# EAGLE design telemetria (EAGLE 9.6.2)
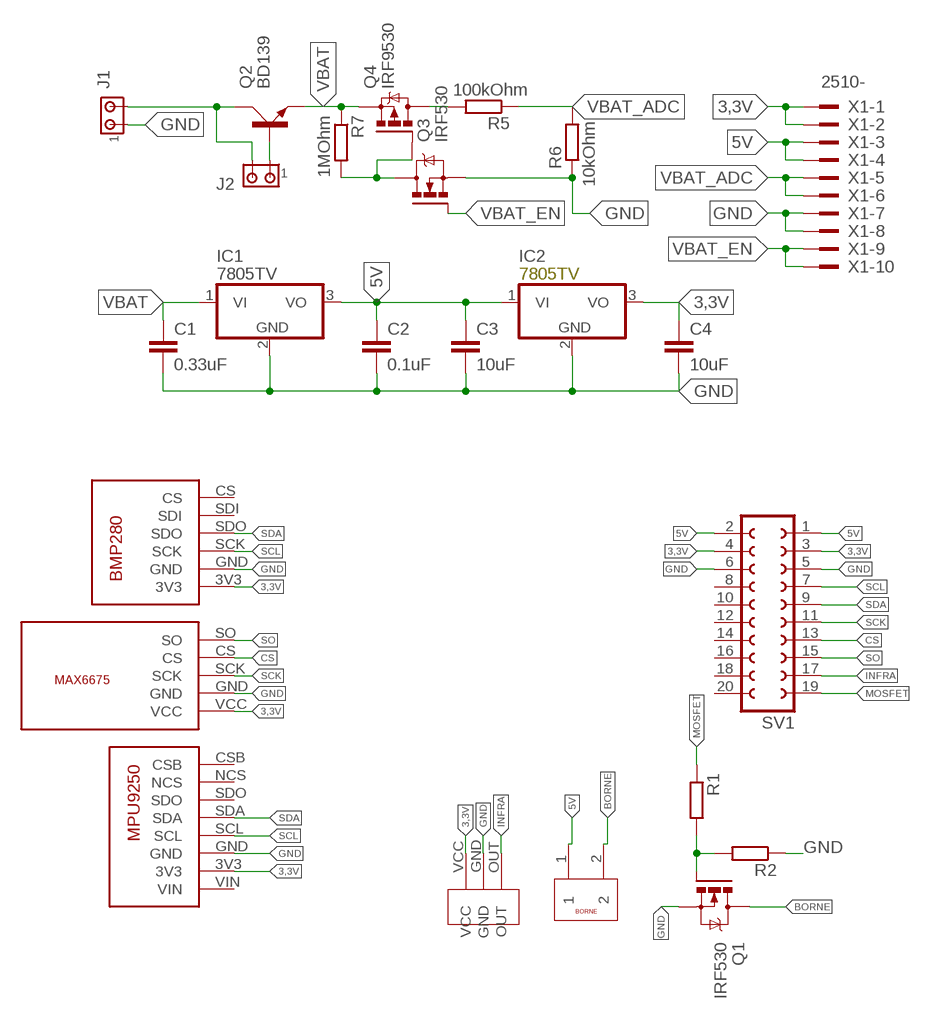
[diagram p0: schematic, sheet 1]

## Parts
C1  0.33uF  C2,5-3  [C2.5-3]
C2  0.1uF  C2,5-3  [C2.5-3]
C3  10uF  C2,5-3  [C2.5-3]
C4  10uF  C2,5-3  [C2.5-3]
IC1  7805TV  [TO220V]
IC2  7805TV  [TO220V]
J1  MTA02-156  [1X2MTA]
J2  MTA02-100  [10X02MTA]
Q1  IRF530  [TO220BV]
Q2  BD139  [TO126AV]
Q3  IRF530  [TO220BV]
Q4  IRF9530  [TO220BV]
R1  R-EU_0204/7  [0204/7]
R2  R-EU_0207/10  [0207/10]
R5  100kOhm  R-EU_0207/10  [0207/10]
R6  10kOhm  R-EU_0207/10  [0207/10]
R7  1MOhm  R-EU_0207/10  [0207/10]
SV1  FE10-2  [FE10-2]
U$1  BMP280  [BMP280]
U$2  MAX6675  [MAX6675]
U$3  MPU9250  [MP9250]
U$4  PIN-INFRA  [PIN-INFRA]
U$5  BORNE  [BORNE]
X1  2510-  [PAK100/2500-10]

## Nets
3,3V: C4.1 IC2.3(VO) SV1.3 SV1.4 U$1.3V3 U$2.VCC U$3.3V3 U$4.VCC X1.1 X1.2
5V: C2.1 C3.1 IC1.3(VO) IC2.1(VI) SV1.1 SV1.2 U$5.1 X1.3 X1.4
BORNE: Q1.D U$5.2
CS: SV1.13 U$2.CS
GND: C1.2 C2.2 C3.2 C4.2 IC1.2(GND) IC2.2(GND) J1.1 Q1.S Q3.S R2.1 R6.1 SV1.5 SV1.6 U$1.GND U$2.GND U$3.GND U$4.GND X1.7 X1.8
INFRA: SV1.17 U$4.OUT
MOSFET: Q1.G R1.1 R1.2 R2.2 SV1.19
N$3: J2.1 Q2.B
N$10: Q4.D R5.2
N$11: J1.2 J2.2 Q2.C
N$12: Q3.D Q4.G R7.2
SCK: SV1.11 U$2.SCK
SCL: SV1.7 U$1.SCK U$3.SCL
SDA: SV1.9 U$1.SDO U$3.SDA
SO: SV1.15 U$2.SO
VBAT: C1.1 IC1.1(VI) Q2.E Q4.S R7.1
VBAT_ADC: R5.1 R6.2 X1.5 X1.6
VBAT_EN: Q3.G X1.9 X1.10
Unconnected: SV1.8 SV1.10 SV1.12 SV1.14 SV1.16 SV1.18 SV1.20 U$1.CS U$1.SDI U$3.CSB U$3.NCS U$3.SDO U$3.VIN

## Library data of the parts
C1-C4 = capacitor-wima:C: CAPACITOR naming: grid - package width
IC1 IC2 = linear:78*: Positive VOLTAGE REGULATOR Source: http://cache.national.com/ds/LM/LM78L05.pdf http://www.fairchildsemi.com/ds/LM/LM7805.pdf
J1 = con-amp:MTA02-156: AMP connector
J2 = con-amp:MTA02-100: AMP connector
Q1 Q3 = transistor-power:IRF530: HEXFET Power MOSFET
Q2 = transistor-power:BD139: NPN TRANSISTOR
Q4 = transistor-power:IRF9530: P-CHANNEL HEXFET POWER-MOS-FET Source: http://www.irf.com/product-info/datasheets/data/irf9530.pdf
R1 R2 R5-R7 = rcl:R-EU_: RESISTOR, European symbol; SPICEPREFIX: R
SV1 = con-lsta:FE10-2: FEMALE HEADER; OC_FARNELL: unknown; OC_NEWARK: unknown
U$1 = BMP280:BMP280
U$2 = MAX6675:MAX6675
U$3 = MPU9250:MPU9250
U$4 = PIN-INFRA:PIN-INFRA
U$5 = BORNE:BORNE
X1 = con-3m:2510-: 3M (TM) Pak 100 4-Wall Header Source: 3M; MF: 3M; MPN: 2510-6002UB; OC_FARNELL: 9838244; OC_NEWARK: 46F4725

## Board
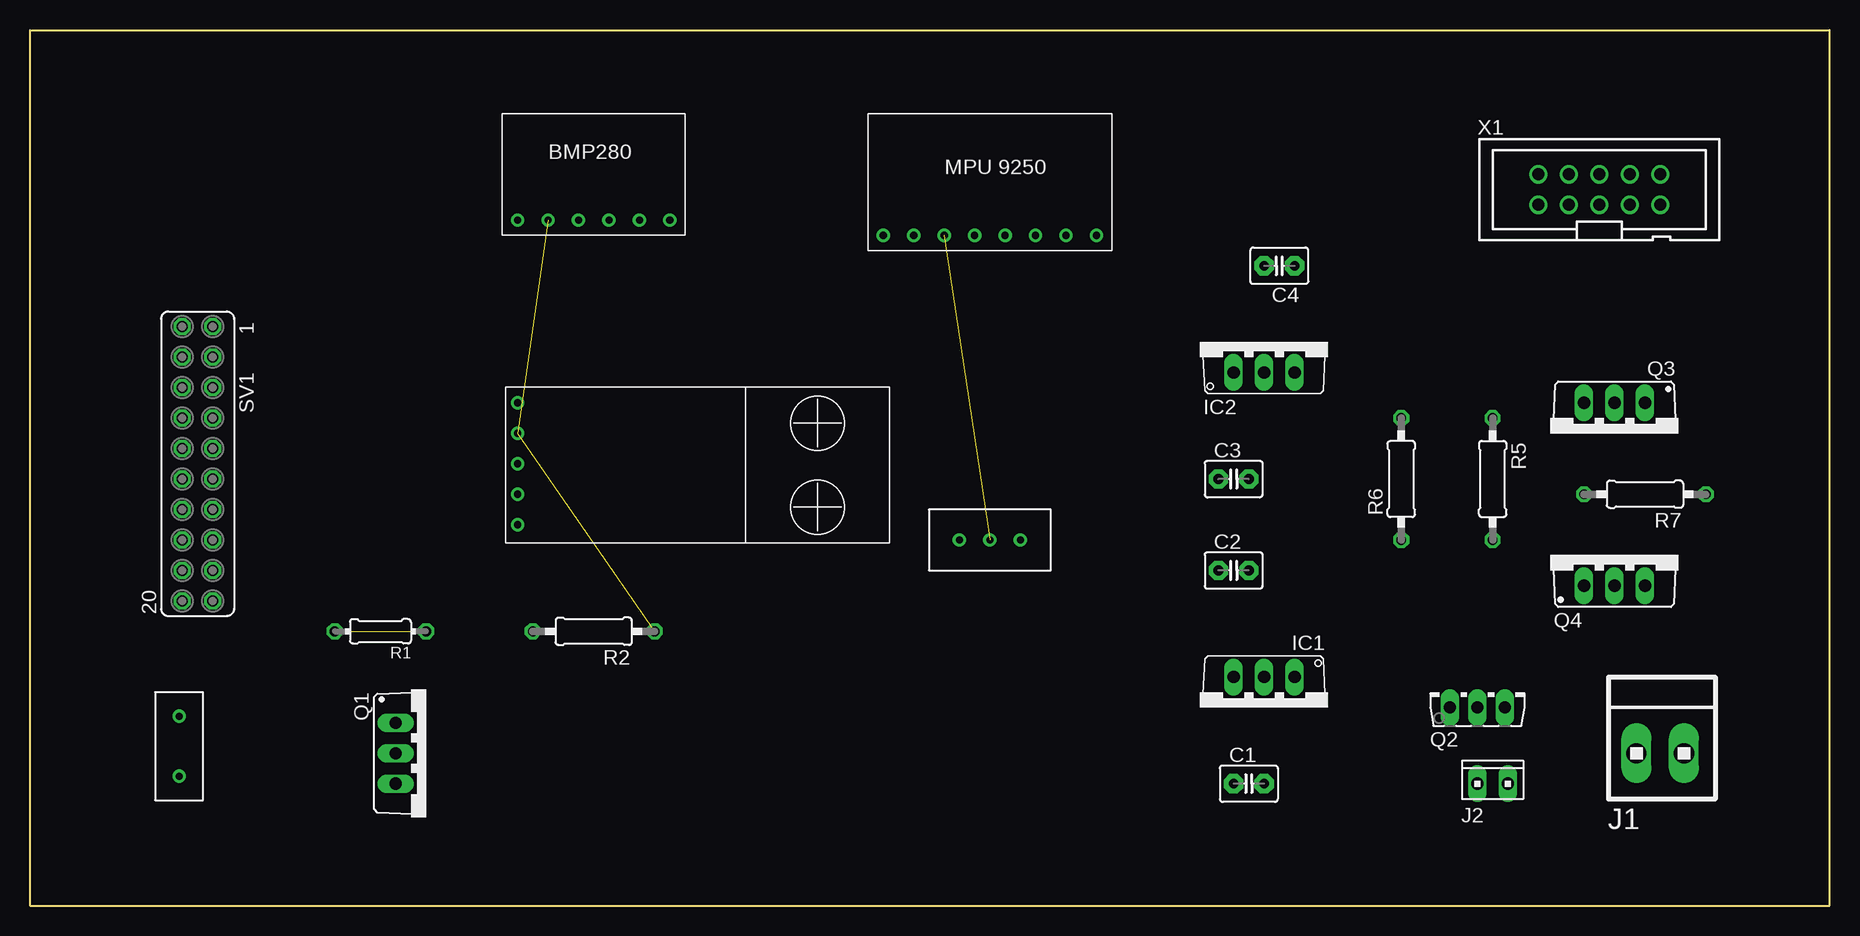
[diagram p1: board, top side]
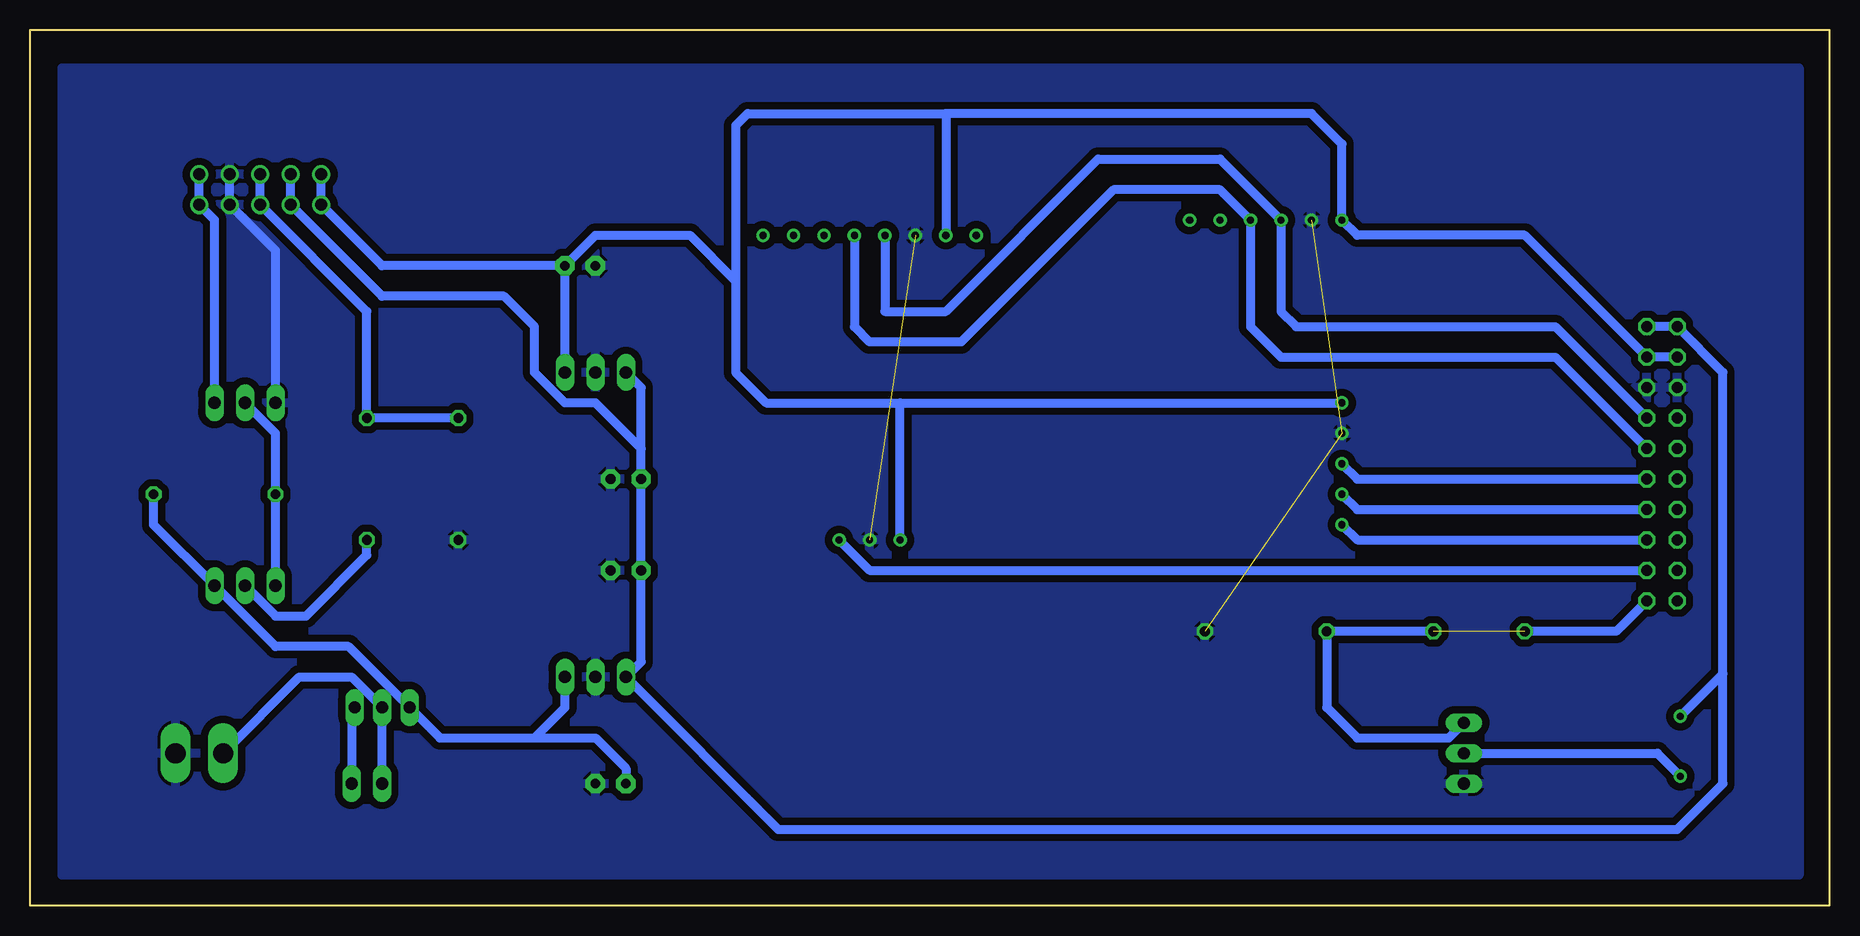
[diagram p2: board, bottom side, seen from below]

Size 150 x 73 mm. Coordinates in mm from the lower left corner, seen from the top.
Outline: 0,0 150,0 150,73 0,73 0,0
Copper layers (1*16): Top 0.035mm / dielectric 1.5mm / Bottom 0.035mm
Design rules "default *": minimum track width 6mil, minimum drill 0.35mm, track to track 6mil, track to pad 6mil, pad to pad 6mil, via to via 6mil, smd to smd 6mil, copper to edge 40mil, drill to drill 6mil, minimum pad ring 10mil, minimum via ring 8mil, stop-mask expansion 4mil, vias tented up to drill 0mil, thermal gap 10mil

### Footprints (pad centres in the part's own frame; a part is rotated, then mirrored left to right if it is on the bottom)
C2.5-3 = drill 0.813 pad 1.6 octagon: 1 -1.27,0; 2 1.27,0
TO220V = drill 1.016 long: 1 -2.54,-2.54; 2 0,-2.54; 3 2.54,-2.54
1X2MTA = drill 1.676 long: 1 1.981,0; 2 -1.981,0
10X02MTA = drill 1.016 long: 1 1.27,0; 2 -1.27,0
TO220BV = drill 1.016 long: D 0,-2.54; G -2.54,-2.54; S 2.54,-2.54
TO126AV = drill 1.016 long: B 2.286,-1.27; C 0,-1.27; E -2.286,-1.27
0204/7 = drill 0.813 octagon: 1 -3.81,0; 2 3.81,0
0207/10 = drill 0.813 octagon: 1 -5.08,0; 2 5.08,0
FE10-2 = drill 0.914 octagon: 1 -11.43,1.27; 2 -11.43,-1.27; 3 -8.89,1.27; 4 -8.89,-1.27; 5 -6.35,1.27; 6 -6.35,-1.27; 7 -3.81,1.27; 8 -3.81,-1.27; 9 -1.27,1.27; 10 -1.27,-1.27; 11 1.27,1.27; 12 1.27,-1.27; 13 3.81,1.27; 14 3.81,-1.27; 15 6.35,1.27; 16 6.35,-1.27; 17 8.89,1.27; 18 8.89,-1.27; 19 11.43,1.27; 20 11.43,-1.27
BMP280 = drill 0.6: 3V3 7.62,2.54; CS 20.32,2.54; GND 10.16,2.54; SCK 12.7,2.54; SDI 17.78,2.54; SDO 15.24,2.54
MAX6675 = drill 0.6: CS 0,5.08; GND 0,10.16; SCK 0,7.62; SO 0,2.54; VCC 0,12.7
MP9250 = drill 0.6: 3V3 5.08,2.54; CSB 20.32,2.54; GND 7.62,2.54; NCS 17.78,2.54; SCL 10.16,2.54; SDA 12.7,2.54; SDO 15.24,2.54; VIN 2.54,2.54
PIN-INFRA = drill 0.6: GND 5.08,2.54; OUT 7.62,2.54; VCC 2.54,2.54
BORNE = drill 0.6: 1 2,1; 2 7,1
PAK100/2500-10 = drill 1 pad 1.422: 1 -5.08,-1.27; 2 -5.08,1.27; 3 -2.54,-1.27; 4 -2.54,1.27; 5 0,-1.27; 6 0,1.27; 7 2.54,-1.27; 8 2.54,1.27; 9 5.08,-1.27; 10 5.08,1.27

### Placement (x,y rotation side)
C1  101.6,10.16 0 top
C2  100.33,27.94 0 top
C3  100.33,35.56 0 top
C4  104.14,53.34 180 top
IC1  102.87,16.51 180 top
IC2  102.87,46.99 0 top
J1  135.89,12.7 0 top
J2  121.92,10.16 0 top
Q1  33.02,12.7 270 top
Q2  120.65,17.78 0 top
Q3  132.08,39.37 180 top
Q4  132.08,29.21 0 top
R1  29.21,22.86 180 top
R2  46.99,22.86 180 top
R5  121.92,35.56 270 top
R6  114.3,35.56 90 top
R7  134.62,34.29 180 top
SV1  13.97,36.83 270 top
U$1  33.02,54.61 0 top
U$2  40.64,29.21 0 top
U$3  68.58,53.34 0 top
U$4  74.93,27.94 0 top
U$5  11.43,17.78 270 top
X1  130.81,59.69 0 top

### Tracks (layer width: path | path; a pad name or v marks a point on that pad's centre or on a via)
3,3V
  Bottom 0.75: 73.66,66.04 U$3.3V3 | 73.66,66.04 43.18,66.04 40.64,63.5 U$1.3V3 39.37,55.88 25.4,55.88 SV1.3 SV1.4 | U$4.VCC 77.47,41.91 | 77.47,41.91 U$2.VCC | 91.17,52.07 91.17,65.04 90.17,66.04 73.66,66.04 | 91.17,52.07 91.17,44.45 88.63,41.91 77.47,41.91 | X1.2 X1.1 120.65,53.34 C4.1 | IC2.3 C4.1 | C4.1 102.87,55.88 94.98,55.88 91.17,52.07
5V
  Bottom 0.75: U$5.1 8.89,19.32 | 8.89,19.32 8.89,44.45 SV1.2 SV1.1 | 99.06,38.1 C3.1 C2.1 99.06,20.32 IC1.3 87.63,6.35 12.7,6.35 8.89,10.16 8.89,19.32 | 99.06,38.1 99.06,43.18 IC2.1 | 99.06,38.1 102.87,41.91 105.41,41.91 107.95,44.45 107.95,48.26 110.49,50.8 120.65,50.8 X1.3 X1.4
BORNE
  Bottom 0.75: Q1.D 14.35,12.7 U$5.2
CS
  Bottom 0.75: U$2.CS 39.37,33.02 SV1.13
GND  (3 unrouted)
  Bottom 0.75: Q3.S 129.54,54.61 X1.7 X1.8
  pour Bottom (isolate 0.61): 2.54,69.85 2.54,2.54 147.32,2.54 147.32,69.85
INFRA
  Bottom 0.75: U$4.OUT 80.01,27.94 SV1.17
MOSFET  (1 unrouted)
  Bottom 0.75: Q1.G 31.75,13.97 39.37,13.97 41.91,16.51 R2.2 R1.1 | SV1.19 17.78,22.86 R1.2
N$3
  Bottom 0.75: Q2.B 123.19,16.26 J2.1
N$10
  Bottom 0.75: Q4.D 129.54,24.13 127,24.13 121.92,29.21 R5.2
N$11
  Bottom 0.75: J1.2 127.56,19.05 123.19,19.05 Q2.C J2.2
N$12
  Bottom 0.75: Q4.G R7.2 129.54,39.37 Q3.D
SCK
  Bottom 0.75: U$2.SCK 39.37,35.56 SV1.11
SCL
  Bottom 0.75: SV1.7 22.86,48.26 44.45,48.26 45.72,49.53 U$1.SCK 50.8,62.23 60.96,62.23 73.66,49.53 78.74,49.53 U$3.SCL
SDA
  Bottom 0.75: SV1.9 22.86,45.72 45.72,45.72 48.26,48.26 U$1.SDO 50.8,59.69 59.69,59.69 72.38,46.99 80.01,46.99 81.28,48.26 U$3.SDA
SO
  Bottom 0.75: U$2.SO 39.37,30.48 SV1.15
VBAT
  Bottom 0.75: 107.95,13.97 115.82,13.97 Q2.E 123.44,21.59 129.54,21.59 Q4.S 139.7,31.75 R7.1 | 107.95,13.97 102.87,13.97 100.33,11.43 C1.1 | 107.95,13.97 105.41,16.51 IC1.1
VBAT_ADC
  Bottom 0.75: R6.2 R5.1 121.92,49.53 X1.5 X1.6
VBAT_EN
  Bottom 0.75: Q3.G 134.62,57.15 X1.9 X1.10